# Altium schematic sheet SeriesSwitch.SchDoc
size A
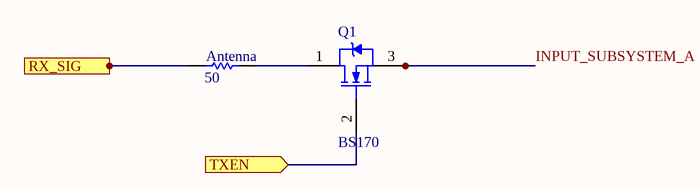
[diagram p0: SeriesSwitch.SchDoc]

## Parts
Antenna  value 50  (hidden comment: Resistor)
Q1  BS170  [ONSC-TO-92-3-29-11]

## Ports
RX_SIG (in), TXEN (in)

## Nets
INPUT_SUBSYSTEM_A: Q1.3(S)
RX_SIG: Antenna.1 ; port RX_SIG
TXEN: Q1.2(G) ; port TXEN
NetAntenna_2: Antenna.2 Q1.1(D)

## Library data of the parts
Antenna = Resistor: TC1: 0; SimulationGenericComponent: True; TC2: 0
Q1 = CMP-1058-00929-1: Small Signal MOSFET, 500 mA, 60 V, N-Channel, 3-Pin TO-92, Bulk Box; Manufacturer: On Semiconductor; VGS Max (V): 20; Configuration: Single; PD Max (W): 0.35; VGS(th) Max (V): 3; ID Max (A): 0.5; V(BR)DSS Min (V): 60; Channel Polarity: N Channel; PackageDescription: 3-Pin Transistor Outline, Body 4.825 x 3.685 mm, Pitch 1.27 mm; Package Type: TO-92; ComponentLink1Description: Manufacturer URL; ComponentLink1URL: http://www.onsemi.com/; DatasheetVersion: Rev. 6; ComponentLink3Description: Package Specification; PartNumber: BS170; ComponentLink2URL: http://www.onsemi.com/pub_link/Collateral/BS170-D.PDF; PackageVersion: Rev. AM; Mounting Technology: Through Hole; PackageReference: TO-92-3-29-11_AM_SL; ComponentLink2Description: Datasheet; ComponentLink3URL: http://www.onsemi.cn/pub_link/Collateral/2N6426-D.PDF; Packing: Bulk Box